# Altium project V40TestAdapter.PrjPCB
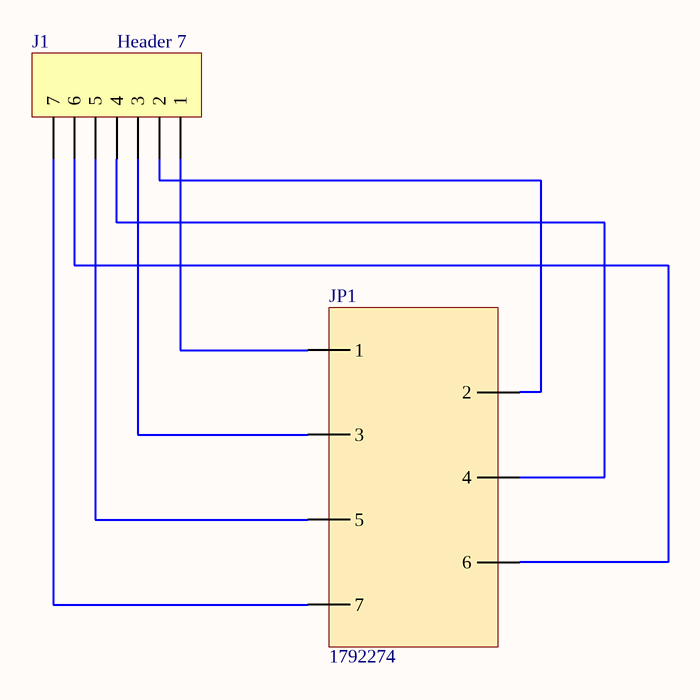
[diagram p0: V40TestAdapter.SchDoc]
1 sheet, 2 parts. Net scope: global (net labels, ports and power ports of the same name join across sheets).
Board files: V40TestAdapter.PcbDoc, Sheild.PcbDoc

## Sheet V40TestAdapter.SchDoc
size A4

### Parts
J1  Header 7  [HDR1X7]
JP1  1792274  [7P Terminal Block]

### Nets
NetJ1_1: J1.1 JP1.1
NetJ1_2: J1.2 JP1.2
NetJ1_3: J1.3 JP1.3
NetJ1_4: J1.4 JP1.4
NetJ1_5: J1.5 JP1.5
NetJ1_6: J1.6 JP1.6
NetJ1_7: J1.7 JP1.7

### Notes on the sheet
- Title
- Size:
- Date:
- A4
- Number:
- Time:
- Revision:
- Sheet
- of
- File:

### Library data of the parts
J1 = Header 7: Header, 7-Pin; LatestRevisionDate: 17-Jul-2002; LatestRevisionNote: Re-released for DXP Platform.; Publisher: Altium Limited
JP1 = PCB Terminal Block